# Altium schematic sheet blokadni_kondenzatori.SchDoc
size A4; DocumentNumber: 8; SheetNumber: 8; SheetTotal: 8
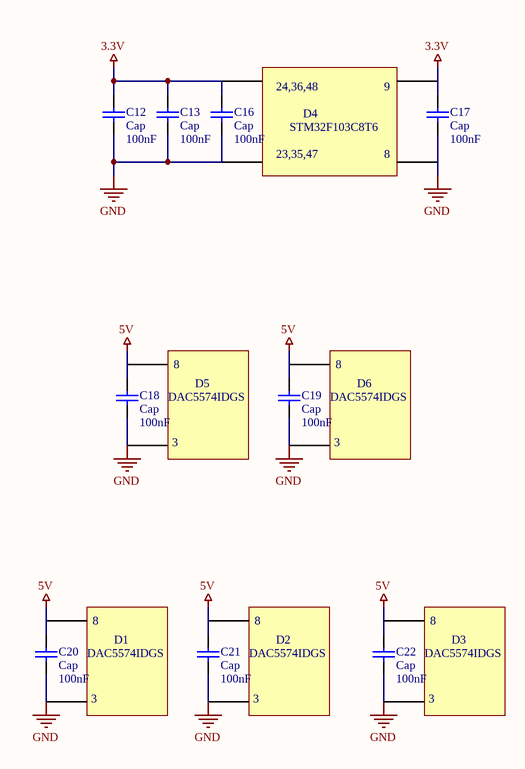
[diagram p0: blokadni_kondenzatori.SchDoc]

## Parts
C12  Cap  value 100nF  [6-0805_L]
C13  Cap  value 100nF  [6-0805_L]
C16  Cap  value 100nF  [6-0805_L]
C17  Cap  value 100nF  [6-0805_L]
C18  Cap  value 100nF  [6-0805_L]
C19  Cap  value 100nF  [6-0805_L]
C20  Cap  value 100nF  [6-0805_L]
C21  Cap  value 100nF  [6-0805_L]
C22  Cap  value 100nF  [6-0805_L]

## Nets
3.3V: C12.2 C13.2 C16.2 C17.2
5V: C18.2 C19.2 C20.2 C21.2 C22.2
GND: C12.1 C13.1 C16.1 C17.1 C18.1 C19.1 C20.1 C21.1 C22.1

## Notes on the sheet
- 24,36,48
- (near C17) 9
- 23,35,47
- STM32F103C8T6
- D4
- 8
- DAC5574IDGS
- (near C18) 8
- D5
- (near C19) DAC5574IDGS
- (near C19) 8
- D6
- 3
- (near C20) 8
- (near C21) 8
- (near C22) 8
- D1
- (near C21) DAC5574IDGS
- D2
- (near C22) DAC5574IDGS
- D3

## Library data of the parts
C12 C13 C16-C22 = Cap: Capacitor; Published: 8-Jun-2000; LatestRevisionDate: 17-Jul-2002; LatestRevisionNote: Re-released for DXP Platform.; PackageReference: RAD-0.3; Publisher: Altium Limited; PackageDescription: Radial Cap, Thru-Hole; 2 Leads; 0.3 in Pin Spacing